# EasyEDA Pro project 智能车电驱.epro

# Schematic Schematic1
Board Name: Board1; Create Date: 2026-01-22; Page Name: P1; Project Name: 智能车电驱; Schematic Name: Schematic1; Update Date: 2026-01-22; Company: 轲硬件工作室; Drawed: 轲; Page Size: A4; Reviewed: 轲; Version: V1.0
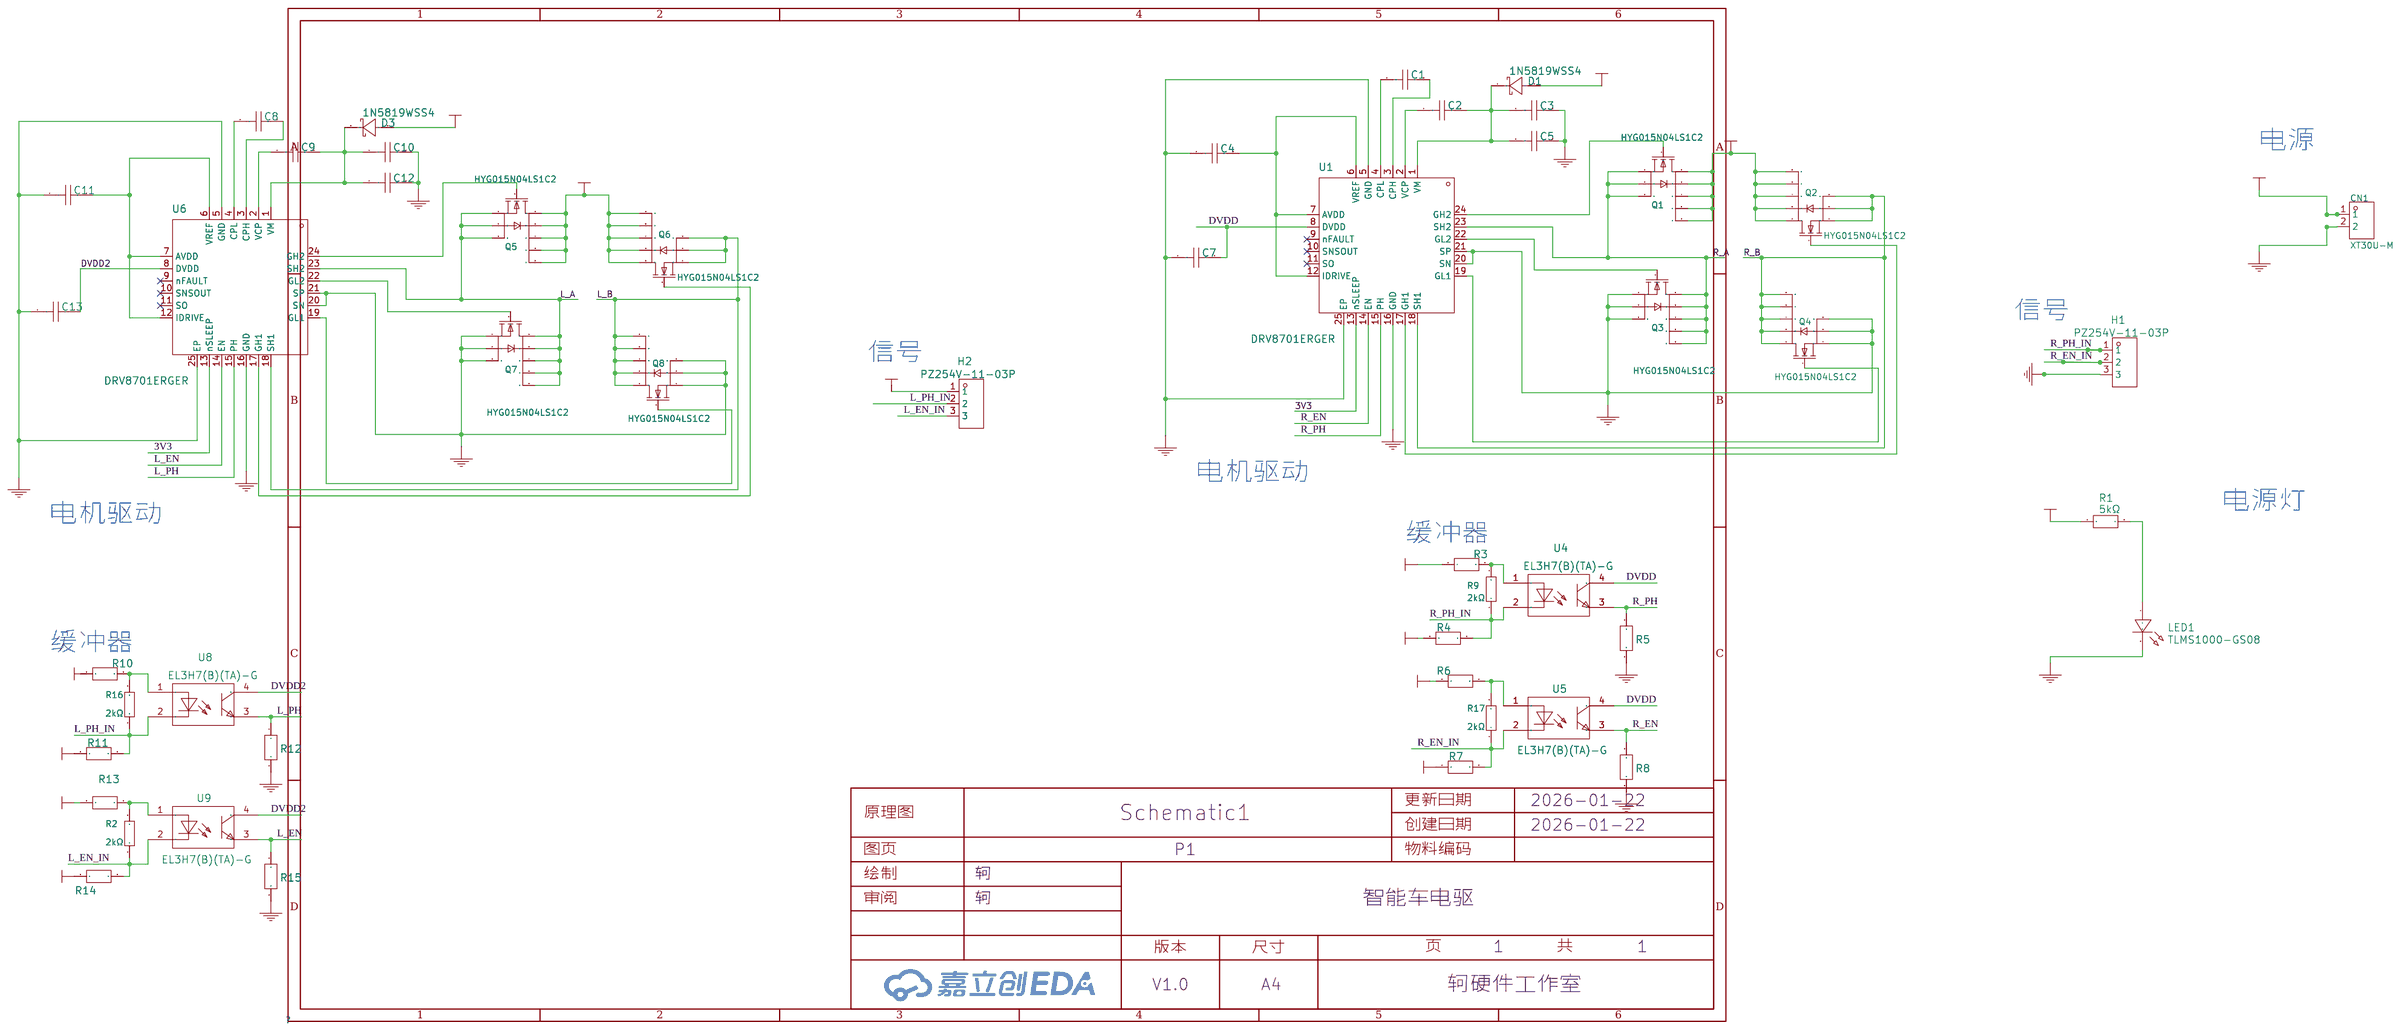
[diagram p0: schematic sheet]

## Parts
C1  100nF  [C0603]
C2  1uF  [C0603]
C3  10nF  [C0603]
C4  1uF  [C0603]
C5  100nF  [C0603]
C7  1uF  [C0603]
C8  100nF  [C0603]
C9  1uF  [C0603]
C10  10nF  [C0603]
C11  1uF  [C0603]
C12  100nF  [C0603]
C13  1uF  [C0603]
CN1  XT30U-M  [CONN-TH_XT30U-M]
D1  1N5819WSS4  [SOD-323_L1.6-W1.3-LS2.7-RD]
D3  1N5819WSS4  [SOD-323_L1.6-W1.3-LS2.7-RD]
H1  PZ254V-11-03P  [HDR-TH_3P-P2.54-V-M]
H2  PZ254V-11-03P  [HDR-TH_3P-P2.54-V-M]
LED1  TLMS1000-GS08  [LED0603-R-RD]
Q1  HYG015N04LS1C2  [DFN-8_L5.9-W5.2-P1.27-LS6.2-BL]
Q2  HYG015N04LS1C2  [DFN-8_L5.9-W5.2-P1.27-LS6.2-BL]
Q3  HYG015N04LS1C2  [DFN-8_L5.9-W5.2-P1.27-LS6.2-BL]
Q4  HYG015N04LS1C2  [DFN-8_L5.9-W5.2-P1.27-LS6.2-BL]
Q5  HYG015N04LS1C2  [DFN-8_L5.9-W5.2-P1.27-LS6.2-BL]
Q6  HYG015N04LS1C2  [DFN-8_L5.9-W5.2-P1.27-LS6.2-BL]
Q7  HYG015N04LS1C2  [DFN-8_L5.9-W5.2-P1.27-LS6.2-BL]
Q8  HYG015N04LS1C2  [DFN-8_L5.9-W5.2-P1.27-LS6.2-BL]
R1  5kΩ  [R0603]
R2  2kΩ  [R0603]
R3  1kΩ  [R0603]
R4  10kΩ  [R0603]
R5  10kΩ  [R0603]
R6  1kΩ  [R0603]
R7  10kΩ  [R0603]
R8  10kΩ  [R0603]
R9  2kΩ  [R0603]
R10  1kΩ  [R0603]
R11  10kΩ  [R0603]
R12  10kΩ  [R0603]
R13  1kΩ  [R0603]
R14  10kΩ  [R0603]
R15  10kΩ  [R0603]
R16  2kΩ  [R0603]
R17  2kΩ  [R0603]
U1  DRV8701ERGER  [VQFN-24_L4.0-W4.0-P0.50-BL-EP2.5]
U4  EL3H7(B)(TA)-G  [SOP-4_L4.4-W2.8-P1.27-LS7.0-TL]
U5  EL3H7(B)(TA)-G  [SOP-4_L4.4-W2.8-P1.27-LS7.0-TL]
U6  DRV8701ERGER  [VQFN-24_L4.0-W4.0-P0.50-BL-EP2.5]
U8  EL3H7(B)(TA)-G  [SOP-4_L4.4-W2.8-P1.27-LS7.0-TL]
U9  EL3H7(B)(TA)-G  [SOP-4_L4.4-W2.8-P1.27-LS7.0-TL]

## Library data of the parts
C1 C5 C8 C12 = CC0805KRX7R9BB104: 容值:100nF;精度:±10%;额定电压:50V;材质(温度系数):X7R;; LCSC Part Name: 100nF ±10% 50V; Supplier Part: C49678; Manufacturer: YAGEO(国巨); Supplier Footprint: 0805; JLCPCB Part Class: Basic Part; Datasheet: https://atta.szlcsc.com/upload/public/pdf/source/20151026/1457707504898.pdf; Supplier: LCSC; Tolerance: ±10%; Voltage Rated: 50V; Temperature Coefficient: X7R
C2 C4 C7 C9 C11 C13 = CC0805KKX7R9BB105: 容值:1uF;精度:±10%;额定电压:50V;材质(温度系数):X7R;; LCSC Part Name: 1uF ±10% 50V; Supplier Part: C91185; Manufacturer: YAGEO(国巨); Supplier Footprint: 0805; JLCPCB Part Class: Extended Part; Datasheet: https://atta.szlcsc.com/upload/public/pdf/source/20180326/C91185_73E5753CCDA19AEA5F66F742ADC085F8.pdf; Supplier: LCSC; Tolerance: ±10%; Voltage Rated: 50V; Temperature Coefficient: X7R
C3 C10 = CC0805KRX7R9BB103: 容值:10nF;精度:±10%;额定电压:50V;材质(温度系数):X7R;; LCSC Part Name: 10nF ±10% 50V; Supplier Part: C83170; Manufacturer: YAGEO(国巨); Supplier Footprint: 0805; JLCPCB Part Class: Extended Part; Datasheet: https://atta.szlcsc.com/upload/public/pdf/source/20160918/1474166948353.pdf; Supplier: LCSC; Tolerance: ±10%; Voltage Rated: 50V; Temperature Coefficient: X7R
CN1 = XT30U-M: 模型插头轻量版锂电池插头; LCSC Part Name: AMASS(艾迈斯)轻量版锂电池插头公头 XT30U-M; Supplier Part: C99101; Manufacturer: AMASS(艾迈斯); JLCPCB Part Class: 扩展库; Datasheet: https://atta.szlcsc.com/upload/public/pdf/source/20170606/1496716542582.pdf; Supplier: LCSC
D1 D3 = 1N5819WS S4_C2927280: 二极管配置:独立式;直流反向耐压(Vr):40V;平均整流电流(Io):350mA;正向压降(Vf):600mV@200mA;反向电流(Ir):5uA@30V;; LCSC Part Name: 40V 350mA 600mV@200mA; Supplier Part: C2927280; Manufacturer: JSMSEMI(杰盛微); Supplier Footprint: SOD-323; JLCPCB Part Class: ExtendedPart; Datasheet: https://atta.szlcsc.com/upload/public/pdf/source/20211230/020DF3ABCB41CBA5E28580D63AFB2CA3.pdf; Supplier: LCSC; Diode Configuration: 独立式; Reverse Voltage (Vr): 40V; Average Rectified Current (Io): 350mA; Forward Voltage (Vf@If): 600mV@200mA; Reverse Leakage Current (Ir): 5uA@30V
H1 H2 = PZ254V-11-03P: 排数:单排;总PIN位数:3;间距:2.54mm;插针结构:1x3P;行距:-;安装类型:直插;圆针/方针:方针;额定电流:3A;额定电压:250V;配合针长度:6mm;塑高:2.5mm;端接针长度:3mm;工作温度范围:-40℃~+105℃;颜色:黑色;; LCSC Part Name: 2.54mm 1x3P 直插 方针; Supplier Part: C2937625; Manufacturer: XFCN(兴飞); Supplier Footprint: 直插,P=2.54mm; JLCPCB Part Class: ExtendedPart; Datasheet: https://atta.szlcsc.com/upload/public/pdf/source/20200309/C492402_8335C3D49C4E4C618838D59BB1D024C1.pdf; Supplier: LCSC; Number of Rows: 单排; Number of Pins: 3; Pitch: 2.54mm; Pin Structure: 1x3P; Mounting Type: 直插; Circluar Pins/Square Pins: 方针; Current Rating (Max): 3A; Voltage Rating (Max): 250V; Length of Mating Pin: 6mm; Insulation Height: 2.5mm; Length of End Connection Pin: 3mm; Operating Temperature Range: -40℃~+105℃; Color: 黑色
LED1 = TLMS1000-GS08: 发光颜色:红灯;; LCSC Part Name: 红灯; Supplier Part: C241893; Manufacturer: VISHAY(威世); Supplier Footprint: 0603; JLCPCB Part Class: Extended Part; Datasheet: https://atta.szlcsc.com/upload/public/pdf/source/20180719/C241893_4BC7C846B3C52AB2D39E337E84999DF0.pdf; Supplier: LCSC; Emitted Color: 红灯
Q1-Q8 = HYG015N04LS1C2: 类型:N沟道;漏源电压(Vdss):40V;连续漏极电流(Id):150A;功率(Pd):75W;导通电阻(RDS(on)@Vgs,Id):1.4mΩ@10V,20A;阈值电压(Vgs(th)@Id):1.9V@250uA;栅极电荷(Qg@Vgs):27nC@4.5V;输入电容(Ciss@Vds):4.05nF@25V;反向传输电容(Crss@Vds):33pF@25V;工作温度:-55℃~+175℃@(Tj);; LCSC Part Name: N沟道40V150A; Supplier Part: C2874970; Manufacturer: HUAYI(华羿微); Supplier Footprint: DFN-8(5.2x5.9); JLCPCB Part Class: ExtendedPart; Datasheet: https://atta.szlcsc.com/upload/public/pdf/source/20210813/C5CB7DC3536D10310F1C24584D22DB85.pdf; Supplier: LCSC; Type: N沟道; Drain Source Voltage (Vdss): 40V; Continuous Drain Current (Id): 150A; Power Dissipation (Pd): 75W; Drain Source On Resistance (RDS(on)@Vgs,Id): 1.4mΩ@10V,20A; Gate Threshold Voltage (Vgs(th)@Id): 1.9V@250uA; Total Gate Charge (Qg@Vgs): 27nC@4.5V; Input Capacitance (Ciss@Vds): 4.05nF@25V; Reverse Transfer Capacitance (Crss@Vds): 33pF@25V; Operating Temperature: -55℃~+175℃@(Tj)
R1 = RC0603FR-072K2L: 电阻类型:厚膜电阻;阻值:2.2kΩ;精度:±1%;功率:100mW;; LCSC Part Name: 2.2kΩ ±1% 100mW; Supplier Part: C114662; Manufacturer: YAGEO(国巨); Supplier Footprint: 0603; JLCPCB Part Class: Extended Part; Datasheet: https://atta.szlcsc.com/upload/public/pdf/source/20170818/C114662_1503051152560895127.pdf; Supplier: LCSC; Type: 厚膜电阻; Tolerance: ±1%; Power(Watts): 100mW; Temperature Coefficient: ±100ppm/℃; Overload Voltage (Max): 75V; Operating Temperature Range: -55℃~+155℃
R2 R9 R16 R17 = 0603WAF2001T5E: 电阻类型:厚膜电阻;阻值:2kΩ;精度:±1%;功率:100mW;; LCSC Part Name: 2kΩ±1%100mW; Supplier Part: C22975; Manufacturer: UNI-ROYAL(厚声); Supplier Footprint: 0603; JLCPCB Part Class: BasicPart; Datasheet: https://atta.szlcsc.com/upload/public/pdf/source/20200306/C422600_1E6D84923E4A46A82E41ADD87F860B5C.pdf; Supplier: LCSC; Type: 厚膜电阻; Tolerance: ±1%; Power(Watts): 100mW; Temperature Coefficient: ±100ppm/℃; Overload Voltage (Max): 75V; Operating Temperature Range: -55℃~+155℃
R3 R6 R10 R13 = RC0603FR-071KL: 电阻类型:厚膜电阻;阻值:1kΩ;精度:±1%;功率:100mW;; LCSC Part Name: 1kΩ ±1% 100mW; Supplier Part: C22548; Manufacturer: YAGEO(国巨); Supplier Footprint: 0603; JLCPCB Part Class: Extended Part; Datasheet: https://atta.szlcsc.com/upload/public/pdf/source/20180312/7BD3618A8B6324EA6280B0497A051AB7.pdf; Supplier: LCSC; Type: 厚膜电阻; Tolerance: ±1%; Power(Watts): 100mW; Temperature Coefficient: ±100ppm/℃; Overload Voltage (Max): 75V; Operating Temperature Range: -55℃~+155℃
R4 R5 R7 R8 R11 R12 R14 R15 = RC0603FR-0710KL: 电阻类型:厚膜电阻;阻值:10kΩ;精度:±1%;功率:100mW;; LCSC Part Name: 10kΩ ±1% 100mW; Supplier Part: C98220; Manufacturer: YAGEO(国巨); Supplier Footprint: 0603; JLCPCB Part Class: Extended Part; Datasheet: https://atta.szlcsc.com/upload/public/pdf/source/20170522/1495423494387.pdf; Supplier: LCSC; Type: 厚膜电阻; Tolerance: ±1%; Power(Watts): 100mW; Temperature Coefficient: ±100ppm/℃; Overload Voltage (Max): 75V; Operating Temperature Range: -55℃~+155℃
U1 U6 = DRV8701ERGER: DRV8701 DRV8701 H 桥栅极驱动器; Supplier Part: C90964; Manufacturer: TI(德州仪器); Supplier Footprint: VQFN-24; JLCPCB Part Class: ExtendedPart; Datasheet: https://atta.szlcsc.com/upload/public/pdf/source/20190902/C90964_2DCC43C1A4AE58E3ED96296E8C78517C.pdf; Supplier: LCSC; Type: 有刷直流电机; Supply Voltage: 0V~5.5V; Interface: 并行; Operating Temperature: -40℃~+125℃@(Ta)
U4 U5 U8 U9 = EL3H7(B)(TA)-G: 输入电压类型:DC;输出通道数:1;正向电压:1.2V;反向电压:6V;输出电流:50mA;接收端电压:80V;集射极饱和电压(Vce(sat)@Ic,IF):100mV@1mA,10mA;隔离电压(rms):3.75kV;; LCSC Part Name: DC输入 隔离电压(rms):3750V; Supplier Part: C32565; Manufacturer: EVERLIGHT(亿光); Supplier Footprint: SOP-4-1.27mm; JLCPCB Part Class: BasicPart; Datasheet: https://atta.szlcsc.com/upload/public/pdf/source/20140621/1457707095564.pdf; Supplier: LCSC; Input voltage type: DC; Output Type: 光电三极管; Number of Outputs: 1; Forward Voltage: 1.2V; Reverse Voltage: 6V; Output Current: 50mA; Receiving End Voltage: 80V; Collector-Emitter Saturation Voltage (Vce(sat)@Ic,IF): 100mV@1mA,10mA; Rise time: 5us@2mA,100Ω; Fall time: 3us@2mA,100Ω; Isolation Voltage(rms): 3.75kV; Operating Temperature: -55℃~+110℃

## Nets
3V3: H2.1 R3.1 R4.2 R6.2 R7.1 R10.1 R11.2 R13.2 R14.1 U1.13(nSLEEP) U6.13(nSLEEP)
DVDD: C7.2 U1.8(DVDD) U4.4(COL) U5.4(COL)
DVDD2: C13.2 U6.8(DVDD) U8.4(COL) U9.4(COL)
GND: C3.2 C4.1 C5.2 C7.1 C10.2 C11.1 C12.2 C13.1 CN1.2 H1.3 LED1.2 Q3.1(S) Q3.2(S) Q3.3(S) Q4.1(S) Q4.2(S) Q4.3(S) Q7.1(S) Q7.2(S) Q7.3(S) Q8.1(S) Q8.2(S) Q8.3(S) R5.2 R8.2 R12.2 R15.2 U1.5(GND) U1.16(GND) U1.20(SN) U1.21(SP) U1.25(EP) U6.5(GND) U6.16(GND) U6.20(SN) U6.21(SP) U6.25(EP)
L_A: Q5.1(S) Q5.2(S) Q5.3(S) Q7.5(D) Q7.6(D) Q7.7(D) Q7.8(D) Q7.9(D) U6.23(SH2)
L_B: Q6.1(S) Q6.2(S) Q6.3(S) Q8.5(D) Q8.6(D) Q8.7(D) Q8.8(D) Q8.9(D) U6.18(SH1)
L_EN: R15.1 U6.14(EN) U9.3(EM)
L_EN_IN: H2.3 R2.1 R14.2 U9.2(CAT)
L_PH: R12.1 U6.15(PH) U8.3(EM)
L_PH_IN: H2.2 R11.1 R16.1 U8.2(CAT)
R_A: Q1.1(S) Q1.2(S) Q1.3(S) Q3.5(D) Q3.6(D) Q3.7(D) Q3.8(D) Q3.9(D) U1.23(SH2)
R_B: Q2.1(S) Q2.2(S) Q2.3(S) Q4.5(D) Q4.6(D) Q4.7(D) Q4.8(D) Q4.9(D) U1.18(SH1)
R_EN: R8.1 U1.14(EN) U5.3(EM)
R_EN_IN: H1.2 R7.2 R17.1 U5.2(CAT)
R_PH: R5.1 U1.15(PH) U4.3(EM)
R_PH_IN: H1.1 R4.1 R9.1 U4.2(CAT)
VM: CN1.1 D1.2(A) D3.2(A) Q1.5(D) Q1.6(D) Q1.7(D) Q1.8(D) Q1.9(D) Q2.5(D) Q2.6(D) Q2.7(D) Q2.8(D) Q2.9(D) Q5.5(D) Q5.6(D) Q5.7(D) Q5.8(D) Q5.9(D) Q6.5(D) Q6.6(D) Q6.7(D) Q6.8(D) Q6.9(D) R1.1
$1N1262: Q3.4(G) U1.22(GL2)
$1N1263: Q4.4(G) U1.19(GL1)
$1N1264: C4.2 U1.6(VREF) U1.7(AVDD) U1.12(IDRIVE)
$1N1265: C1.1 U1.4(CPL)
$1N1266: C2.1 U1.2(VCP)
$1N1267: C2.2 C3.1 C5.1 D1.1(C) U1.1(VM)
$1N1268: Q1.4(G) U1.24(GH2)
$1N1269: Q2.4(G) U1.17(GH1)
$1N1297: C1.2 U1.3(CPH)
$1N1308: LED1.1 R1.2
$1N1312: R3.2 R9.2 U4.1(AN)
$1N1315: R6.1 R17.2 U5.1(AN)
$3N3922: Q7.4(G) U6.22(GL2)
$3N3923: Q8.4(G) U6.19(GL1)
$3N3924: C11.2 U6.6(VREF) U6.7(AVDD) U6.12(IDRIVE)
$3N3925: C8.1 U6.4(CPL)
$3N3926: C9.1 U6.2(VCP)
$3N3927: C9.2 C10.1 C12.1 D3.1(C) U6.1(VM)
$3N3928: Q5.4(G) U6.24(GH2)
$3N3929: Q6.4(G) U6.17(GH1)
$3N3958: C8.2 U6.3(CPH)
$3N3966: R10.2 R16.2 U8.1(AN)
$3N3971: R2.2 R13.1 U9.1(AN)

Not connected (* = marked no-connect by the designer): U1 9(nFAULT)* 10(SNSOUT)* 11(SO)*; U6 9(nFAULT)* 10(SNSOUT)* 11(SO)*

## Notes on the sheet
- 电源
- 信号
- 信号
- 电机驱动
- 电源灯
- 电机驱动
- 缓冲器
- 缓冲器

# Board PCB1
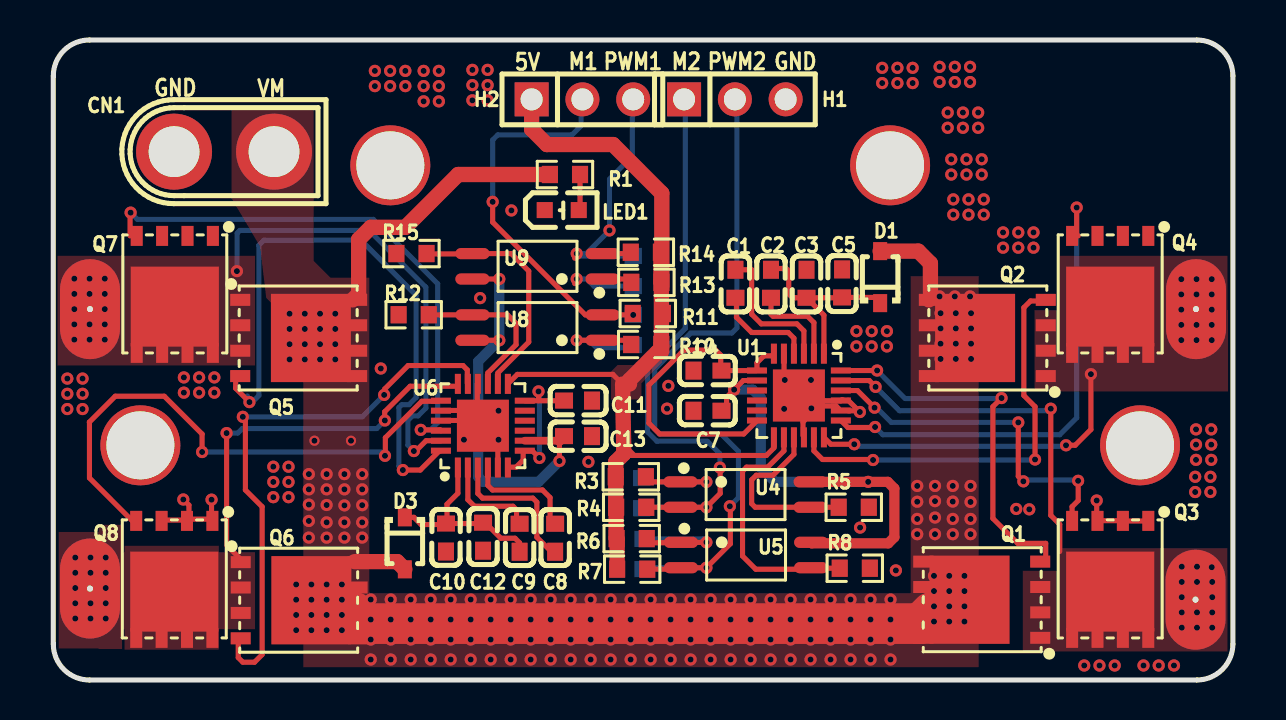
[diagram p1: board, top side]
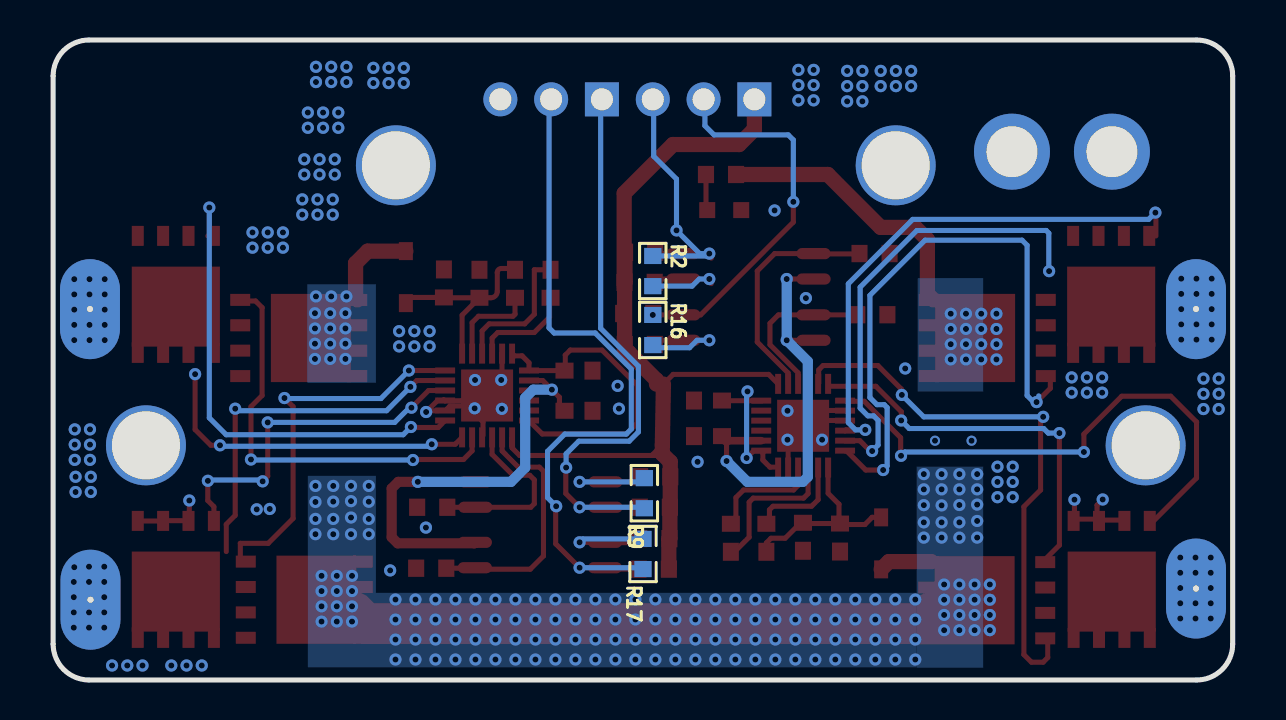
[diagram p2: board, bottom side, seen from below]

Outline 59 x 32 mm; copper layers: Top Layer, Bottom Layer. Coordinates in mm from the lower left corner of the outline.
Outline path: 0,30.2 0,1.8 arc(0.53,0.53) 1.8,0 57.2,0 arc(58.47,0.53) 59,1.8 59,30.2 arc(58.47,31.47) 57.2,32 1.8,32 arc(0.53,31.47) 0,30.2
Stack: Top Layer 0.035mm / Dielectric1 1.51mm FR4 er 4.5 / Bottom Layer 0.035mm

## Design rules (mm)
template: JLCPCB Capability(Two Layers Board)
spacing copperThickness1oz (default): track to track 0.102, other pairs 0.152 to 0.3
spacing copperThickness2oz: track to track 0.203, other pairs 0.152 to 0.3
track width copperThickness1oz (default): min 0.127, default 0.254, max 2.54
track width copperThickness2oz: min 0.203, default 0.254, max 2.54
differential pair differentialPair (default): width min 0.127, default 0.254, max 2.54; gap min 0.152, default 0.152
via viaSize (default): diameter min 0.5, default 0.61, max 10; hole min 0.3, default 0.305, max 6.3

## Placement (name value [footprint] x y rotation side)
C1  100nF  [C0603]  34.12 19.81 90 top
C2  1uF  [C0603]  35.9 19.81 90 top
C3  10nF  [C0603]  37.67 19.81 90 top
C4  1uF  [C0603]  32.72 15.47 0 top
C5  100nF  [C0603]  39.45 19.83 90 top
C7  1uF  [C0603]  32.72 13.46 0 top
C8  100nF  [C0603]  25.1 7.11 270 top
C9  1uF  [C0603]  23.32 7.11 270 top
C10  10nF  [C0603]  19.64 7.12 270 top
C11  1uF  [C0603]  26.24 13.97 180 top
C12  100nF  [C0603]  21.49 7.16 270 top
C13  1uF  [C0603]  26.24 12.19 180 top
CN1  XT30U-M  [CONN-TH_XT30U-M]  8.54 26.42 180 top
D1  1N5819WSS4  [SOD-323_L1.6-W1.3-LS2.7-RD]  41.36 20.14 90 top
D3  1N5819WSS4  [SOD-323_L1.6-W1.3-LS2.7-RD]  17.58 6.83 270 top
H1  PZ254V-11-03P  [HDR-TH_3P-P2.54-V-M]  34.09 29.03 0 top
H2  PZ254V-11-03P  [HDR-TH_3P-P2.54-V-M]  26.46 29.03 0 top
LED1  TLMS1000-GS08  [LED0603-R-RD]  25.43 23.5 0 top
NOREF  -  [Pad_e1132]  54.36 11.73 0 top
NOREF#2  -  [Pad_e1133]  57.13 4.01 90 top
NOREF#3  -  [Pad_e1134]  57.16 18.54 90 top
NOREF#4  -  [Pad_e1130]  16.86 25.73 0 top
NOREF#5  -  [Pad_e1131]  41.85 25.73 0 top
NOREF#6  -  [Pad_e1127]  1.83 4.57 90 top
NOREF#7  -  [Pad_e1129]  4.35 11.73 0 top
NOREF#8  -  [Pad_e1128]  1.83 18.54 90 top
Q1  HYG015N04LS1C2  [DFN-8_L5.9-W5.2-P1.27-LS6.2-BL]  46.44 4.01 90 top
Q2  HYG015N04LS1C2  [DFN-8_L5.9-W5.2-P1.27-LS6.2-BL]  46.72 17.1 90 top
Q3  HYG015N04LS1C2  [DFN-8_L5.9-W5.2-P1.27-LS6.2-BL]  52.86 5.03 180 top
Q4  HYG015N04LS1C2  [DFN-8_L5.9-W5.2-P1.27-LS6.2-BL]  52.86 19.28 180 top
Q5  HYG015N04LS1C2  [DFN-8_L5.9-W5.2-P1.27-LS6.2-BL]  12.27 17.1 270 top
Q6  HYG015N04LS1C2  [DFN-8_L5.9-W5.2-P1.27-LS6.2-BL]  12.3 3.99 270 top
Q7  HYG015N04LS1C2  [DFN-8_L5.9-W5.2-P1.27-LS6.2-BL]  6.08 19.28 180 top
Q8  HYG015N04LS1C2  [DFN-8_L5.9-W5.2-P1.27-LS6.2-BL]  6.05 5.03 180 top
R1  5kΩ  [R0603]  25.59 25.27 0 top
R2  2kΩ  [R0603]  29 20.45 270 bottom
R3  1kΩ  [R0603]  28.88 10.16 0 top
R4  10kΩ  [R0603]  28.9 8.64 180 top
R5  10kΩ  [R0603]  40.04 8.64 0 top
R6  1kΩ  [R0603]  28.93 7.07 180 top
R7  10kΩ  [R0603]  28.95 5.54 0 top
R8  10kΩ  [R0603]  40.09 5.59 0 top
R9  2kΩ  [R0603]  29.43 9.34 90 bottom
R10  1kΩ  [R0603]  29.65 16.78 180 top
R11  10kΩ  [R0603]  29.74 18.33 0 top
R12  10kΩ  [R0603]  18.03 18.26 180 top
R13  1kΩ  [R0603]  29.66 19.88 0 top
R14  10kΩ  [R0603]  29.64 21.39 180 top
R15  10kΩ  [R0603]  17.91 21.32 180 top
R16  2kΩ  [R0603]  29 17.5 270 bottom
R17  2kΩ  [R0603]  29.49 6.3 90 bottom
U1  DRV8701ERGER  [VQFN-24_L4.0-W4.0-P0.50-BL-EP2.5]  37.29 14.22 180 top
U4  EL3H7(B)(TA)-G  [SOP-4_L4.4-W2.8-P1.27-LS7.0-TL]  34.63 9.27 0 top
U5  EL3H7(B)(TA)-G  [SOP-4_L4.4-W2.8-P1.27-LS7.0-TL]  34.65 6.25 0 top
U6  DRV8701ERGER  [VQFN-24_L4.0-W4.0-P0.50-BL-EP2.5]  21.49 12.72 0 top
U8  EL3H7(B)(TA)-G  [SOP-4_L4.4-W2.8-P1.27-LS7.0-TL]  24.22 17.62 180 top
U9  EL3H7(B)(TA)-G  [SOP-4_L4.4-W2.8-P1.27-LS7.0-TL]  24.22 20.68 180 top

## Footprints (pads in the part's own frame, mm; a bottom-side part is the same pattern mirrored in y, then rotated)
C0603
  rect 0.8x0.9 smd: 1(-0.7,0)
  rect 0.9x0.8 smd: 2(0.7,0)
CONN-TH_XT30U-M
  round 3.8 hole 2.54: 1(-2.5,0) 2(2.5,0)
DFN-8_L5.9-W5.2-P1.27-LS6.2-BL
  rect 0.6x1 smd: 1(-1.905,-2.925) 2(-0.635,-2.925) 3(0.635,-2.925) 4(1.905,-2.925) 5(1.905,2.925) 6(0.635,2.925) 7(-0.635,2.925) 8(-1.905,2.925)
  rect 4.41x4 smd: 9(0,0.61)
HDR-TH_3P-P2.54-V-M
  rect 1.7x1.7 hole 1.1: 1(-2.54,0)
  round 1.7 hole 1.1: 2(0,0) 3(2.54,0)
LED0603-R-RD
  rect 0.8x0.8 smd: 1(0.851,0) 2(-0.851,0)
Pad_e1127
  rrect 5.002x2.999 hole 0.305: 1(0,0)
Pad_e1128
  rrect 5.002x2.999 hole 0.305: 1(0,0)
Pad_e1129
  round 4 hole 3.401: 1(0,0)
Pad_e1130
  round 4 hole 3.401: 1(0,0)
Pad_e1131
  round 4 hole 3.401: 1(0,0)
Pad_e1132
  round 4 hole 3.401: 1(0,0)
Pad_e1133
  rrect 5.002x2.999 hole 0.305: 1(0,0)
Pad_e1134
  rrect 5.002x2.999 hole 0.305: 1(0,0)
R0603
  rect 0.806x0.864 smd: 1(-0.753,0) 2(0.753,0)
SOD-323_L1.6-W1.3-LS2.7-RD
  rect 0.9x0.7 smd: 1(-1.3,0) 2(1.3,0)
SOP-4_L4.4-W2.8-P1.27-LS7.0-TL
  oval 1.71x0.56 smd: 1(-3.255,0.635) 2(-3.255,-0.635) 3(3.255,-0.635) 4(3.255,0.635)
VQFN-24_L4.0-W4.0-P0.50-BL-EP2.5
  rect 0.3x1 smd: 1(-1.25,-2.092) 2(-0.75,-2.092) 3(-0.25,-2.092) 4(0.25,-2.092) 5(0.75,-2.092) 6(1.25,-2.092) 13(1.25,2.092) 14(0.75,2.092) 15(0.25,2.092) 16(-0.25,2.092) 17(-0.75,2.092) 18(-1.25,2.092)
  rect 1x0.3 smd: 7(2.098,-1.25) 8(2.098,-0.75) 9(2.098,-0.25) 10(2.098,0.25) 11(2.098,0.75) 12(2.098,1.25) 19(-2.098,1.25) 20(-2.098,0.75) 21(-2.098,0.25) 22(-2.098,-0.25) 23(-2.098,-0.75) 24(-2.098,-1.25)
  rect 2.6x2.6 smd: 25(0.001,-0.001)

## Nets
As in the schematic, except:
L_A: NOREF#8.1 Q5.1 Q5.2 Q5.3 Q7.5 Q7.6 Q7.7 Q7.8 Q7.9 U6.23
L_B: NOREF#6.1 Q6.1 Q6.2 Q6.3 Q8.5 Q8.6 Q8.7 Q8.8 Q8.9 U6.18
R_A: NOREF#2.1 Q1.1 Q1.2 Q1.3 Q3.5 Q3.6 Q3.7 Q3.8 Q3.9 U1.23
R_B: NOREF#3.1 Q2.1 Q2.2 Q2.3 Q4.5 Q4.6 Q4.7 Q4.8 Q4.9 U1.18

Pads without a net: NOREF 1; NOREF#4 1; NOREF#5 1; NOREF#7 1; U1 9 10 11; U6 9 10 11

## Via types
v1: diameter 0.61, hole 0.305, Top Layer to Bottom Layer, 419 vias
v2: diameter 0.508, hole 0.305, Top Layer to Bottom Layer, 3 vias

## Routing (per net, layer and track width the routed paths; a pad name or vN(x,y) marks a point on that pad's centre or on a via; arc(x,y) is an arc through that point)
3V3: length 46.1
  Top Layer w0.254: 28.53,11.3 28.6,11.23 29.06,11.23 ; R10.1 30.41,16.38 ; U6.13 23.21,15.28 27.99,15.28 28.47,14.8 28.82,14.8 ; 29.06,11.23 35.67,11.23 36.04,11.6 U1.13 ; 29.06,11.23 28.53,11.76
  Top Layer w0.762: 30.41,16.38 30.21,16.38 28.82,15 28.82,14.8 ; R7.1 28.2,7.04 R6.2 28.15,7.09 R4.2 28.13,8.66 R3.1 28.13,10.91 28.53,11.3 28.53,11.76 28.47,14.8 ; R14.1 30.39,19.91 R13.2 30.42,16.78 R10.1 ; 23.92,28.92 23.92,27.53 24.69,26.77 28,26.77 30.43,24.33 30.43,19.72
DVDD: length 24.4
  Top Layer w0.254: 35.19,14.97 34.51,14.97 v1(34.05,14.52) 33.67,14.14 33.67,13.72 C7.2
  Top Layer w0.508: 37.88,6.88 37.93,6.83 41.76,6.83 42.07,7.14 42.07,9.58 41.74,9.91 v1(40.76,9.91) U4.4
  Bottom Layer w0.508: 40.8,9.91 36.1,9.91 35.39,10.62 35.39,14.11 34.98,14.52 v1(34.05,14.52)
DVDD2: length 20.6
  Top Layer w0.254: 25.31,11.97 v1(25.31,10.95) ; v1(22.31,20.05) U9.4 ; U8.4 22.23,16.99
  Top Layer w0.381: U6.8 25.31,11.97
  Top Layer w0.508: 25.31,11.97 C13.2
  Bottom Layer w0.508: v1(22.31,16.99) 21.25,15.93 21.25,10.16 21.5,9.91 24.27,9.91 v1(25.31,10.95) ; 22.31,16.99 v1(22.31,20.05)
GND: length 26
  Top Layer w0.254: 38.3,13.7 39.15,13.7 39.3,13.55 ; 38.3,13.7 38.56,13.96 39.4,13.96 39.42,13.98 ; 38.3,13.7 38.18,13.7 ; 38.3,13.7 37.5,12.9 37.5,12.22 ; 6.78,8.04 6.78,8.74 v1(6.5,9.03) ; 6.78,8.04 6.78,8 ; 6.78,8.04 7.86,8.04 7.89,8.02 ; 6.78,8.04 6.71,8.04 ; v1(52.19,8.97) 52.19,8.05 ; 39.42,13.98 39.46,14.02 ; 39.42,13.98 39.76,13.98 40.28,13.46 ; 39.42,13.98 39.4,13.98 ; 19.5,13.48 20.68,13.48 21.18,12.98 ; 6.84,7.99 6.83,8 5.49,8 ; 36.55,16.39 36.55,14.99 38.01,13.52 ; 21.18,12.98 21.21,12.95 ; 21.18,12.98 21.21,12.98 ; 21.18,12.98 19.61,12.98 ; 21.21,12.95 21.21,12.55 22.23,11.53 22.23,10.85 ; 21.21,12.95 21.51,12.65 ; 21.21,12.95 21.21,12.98 ; 21.21,12.98 21.25,12.98 ; 21.21,12.98 21.21,14.83 ; v1(7.91,9.02) 7.91,7.93 7.93,7.92 ; 54.65,7.95 53.65,7.95 ; 53.65,7.95 53.68,7.92 ; 53.65,7.95 53.63,7.97 52.26,7.97 ; 39.75,13.46 40.28,13.46 ; 40.28,13.46 v1(40.34,13.4)
  vias: v1(0.7,15.07) v1(0.7,14.31) v1(0.7,13.55) v1(1.46,15.07) v1(1.46,14.31) v1(1.46,13.55) v1(6.53,15.13) v1(6.53,14.37) v1(7.29,15.13) v1(7.29,14.37) v1(8.05,15.13) v1(8.05,14.37) v1(11,10.67) v1(11,9.9) v1(11,9.14) v1(11.77,10.67) v1(11.77,9.9) v1(11.77,9.14) v1(16.08,30.46) v1(16.08,29.69) v1(16.38,15.58) v1(16.85,30.46) v1(16.85,29.69) v1(17.61,30.46) v1(17.61,29.69) v1(18.52,30.46) v1(18.52,29.69) v1(18.52,28.93) v1(19.28,30.46) v1(19.28,29.69) v1(19.28,28.93) v1(20.54,12.01) v1(20.96,30.51) v1(20.96,29.74) v1(20.96,28.98) v1(21.35,19.09) v1(21.72,30.51) v1(21.72,29.74) v1(21.72,28.98) v1(22.27,13.46) v1(22.27,12.01) v1(22.91,23.48) v1(26.76,10.91) v1(30.76,14.71) v1(30.7,13.57) v1(36.59,15) v1(36.55,13.56) v1(37.9,15) v1(37.91,13.58) v1(40.17,17.44) v1(40.17,16.68) v1(40.35,7.62) v1(40.93,17.44) v1(40.93,16.68) v1(41.46,30.61) v1(41.46,29.85) v1(41.69,17.44) v1(41.69,16.68) v1(42.14,5.48) v1(42.22,30.61) v1(42.22,29.85) v1(42.98,30.61) v1(42.98,29.85) v1(44.33,30.66) v1(44.33,29.9) v1(44.73,28.37) v1(44.73,27.61) v1(44.91,26.04) v1(44.91,25.27) v1(45.01,24.03) v1(45.01,23.27) v1(45.09,30.66) v1(45.09,29.9) v1(45.5,28.37) v1(45.5,27.61) v1(45.67,26.04) v1(45.67,25.27) v1(45.78,24.03) v1(45.78,23.27) v1(45.85,30.66) v1(45.85,29.9) v1(46.26,28.37) v1(46.26,27.61) v1(46.44,26.04) v1(46.44,25.27) v1(46.54,24.03) v1(46.54,23.27) v1(47.5,22.38) v1(47.5,21.62) v1(48.16,8.55) v1(48.27,22.38) v1(48.27,21.62) v1(48.81,8.53) v1(49.03,22.38) v1(49.03,21.62) v1(51.56,0.73) v1(52.33,0.73) v1(53.09,0.73) v1(54.53,0.73) v1(55.29,0.73) v1(56.05,0.73) v1(57.16,12.53) v1(57.16,11.77) v1(57.16,11.01) v1(57.11,10.16) v1(57.11,9.4) v1(57.88,10.16) v1(57.88,9.4) v1(57.92,12.53) v1(57.92,11.77) v1(57.92,11.01)
L_A: length 23
  Top Layer w0.254: v1(18.03,11.45) 18.13,11.45 18.65,11.97 U6.23
  Bottom Layer w0.254: v1(18.03,11.45) 17.74,11.75 17.74,12.98 17.96,13.21 18.25,13.21 18.63,13.59 18.63,19.64 15.8,22.48 9.33,22.48 9.2,22.34 9.2,20.46 v1(9.18,20.44)
  vias: v1(1.05,20.07) v1(1.05,19.31) v1(1.05,18.54) v1(1.05,17.78) v1(1.05,17.02) v1(1.81,20.07) v1(1.81,19.31) v1(1.81,17.78) v1(1.81,17.02) v1(2.57,20.07) v1(2.57,19.31) v1(2.57,18.54) v1(2.57,17.78) v1(2.57,17.02)
L_B: length 19.2
  Top Layer w0.254: v1(8.67,12.35) 8.67,6.74 9.36,6.05 ; 20.09,14.69 17.85,14.69 16.57,13.41 16.57,13.06
  Bottom Layer w0.254: v1(16.58,12.98) 16.18,12.57 9.45,12.57 9.23,12.35 v1(8.67,12.35)
  vias: v1(1.1,6.12) v1(1.1,5.36) v1(1.1,4.6) v1(1.1,3.84) v1(1.1,3.07) v1(1.86,6.12) v1(1.86,5.36) v1(1.86,3.84) v1(1.86,3.07) v1(2.62,6.12) v1(2.62,5.36) v1(2.62,4.6) v1(2.62,3.84) v1(2.62,3.07)
L_EN: length 11.8
  Top Layer w0.254: 18.62,21.3 20.95,21.3 U9.3 22.91,21.32 23.78,20.45 23.78,16.9 22.24,15.35 U6.14
L_EN_IN: length 13.8
  Top Layer w0.254: R14.2 28.82,21.32 U9.2 ; 26.08,21.09 26.18,21.19 v1(26.18,21.32)
  Bottom Layer w0.254: R2.1 26.3,21.2 v1(26.18,21.32) 26.66,21.32 v1(27.82,22.48) 27.82,25.05 28.96,26.19 28.96,28.74 28.67,29.03
L_PH: length 8.1
  Top Layer w0.254: U6.15 21.73,15.36 23.14,16.77 23.14,17.83 22.72,18.26 U8.3 18.88,18.26
L_PH_IN: length 19.3
  Top Layer w0.254: 28.91,18.3 28.87,18.26 U8.2 26.61,18.26 21.97,22.89 v1(21.97,23.91)
  Bottom Layer w0.254: v1(21.97,23.91) 21.97,27 22.23,27.26 25.94,27.26 26.4,27.71 26.4,29.29
  vias: v2(29,18.25)
R_A: length 18.5
  Top Layer w0.254: 50.34,6.42 50.34,7.78 49.89,8.23 v1(49.89,13.56) ; v1(41.13,14.66) 40.81,14.97 39.39,14.97
  Bottom Layer w0.254: v1(41.13,14.66) 42.32,13.46 49.79,13.46 v1(49.89,13.56)
  vias: v1(56.44,5.67) v1(56.44,4.9) v1(56.44,4.14) v1(56.44,3.38) v1(56.44,2.62) v1(57.2,5.67) v1(57.2,4.9) v1(57.2,3.38) v1(57.2,2.62) v1(57.94,5.64) v1(57.97,4.9) v1(57.97,4.14) v1(57.97,3.38) v1(57.97,2.62)
R_B: length 16.7
  Top Layer w0.254: v1(40.06,11.79) 38.89,11.79 U1.18 ; v1(51.9,15.29) 51.9,12.52 51.11,11.74 v1(50.65,11.74)
  Bottom Layer w0.254: v1(40.06,11.79) 40.16,11.69 50.6,11.69 v1(50.65,11.74)
  vias: v1(56.42,20.04) v1(56.42,19.28) v1(56.42,18.52) v1(56.42,17.76) v1(56.42,16.99) v1(57.18,20.04) v1(57.18,19.28) v1(57.18,17.76) v1(57.18,16.99) v1(57.94,20.04) v1(57.94,19.28) v1(57.94,18.52) v1(57.94,17.76) v1(57.94,16.99)
R_EN: length 12.6
  Top Layer w0.254: U1.14 36.54,11.45 35.73,10.64 34.68,10.64 34.47,10.44 34.47,6.2 35.13,5.54 37.83,5.54 37.88,5.59 R8.1
R_EN_IN: length 36.8
  Top Layer w0.254: 31.37,5.61 v1(32.67,5.61) 33.86,6.81 33.86,8.66 v1(33.84,8.69) ; 31.37,5.59 31.32,5.54 R7.2
  Bottom Layer w0.254: 34.46,29.03 34.19,28.77 34.19,17.6 33.94,17.35 31.88,17.35 30.08,15.55 30.08,12.55 30.33,12.3 33.41,12.3 34.27,11.43 34.27,9.12 v1(33.84,8.69) ; R17.1 29.56,5.61 v1(32.67,5.61)
R_PH: length 9.1
  Top Layer w0.254: R5.1 U4.3 35.11,8.64 34.93,8.81 34.93,10.01 35.16,10.24 36,10.24 37.04,11.28 U1.15
R_PH_IN: length 30.6
  Top Layer w0.254: 32.62,8.64 U4.2 29.66,8.64 ; 33.36,10.54 33.36,9.33 v1(32.67,8.64)
  Bottom Layer w0.254: v1(33.34,10.62) 33.34,11.31 32.71,11.94 30.19,11.94 29.72,12.4 29.72,15.69 31.61,17.58 31.61,29.03 ; v1(32.67,8.64) 29.48,8.64 R9.1
VM: length 50.7
  Top Layer w0.762: 14.97,19.01 15.27,19.31 15.27,22.02 15.88,22.63 17.61,22.63 20.25,25.27 R1.1 ; Q2.5 43.87,19.09 43.87,20.83 43.26,21.44 D1.2 ; 15.07,5.92 17.2,5.92 D3.2
  Top Layer w2.032: 15.07,3.38 15.63,2.82 43.36,2.82 43.92,3.38
  vias: v1(11.82,18.31) v1(11.82,17.55) v1(11.82,16.79) v1(11.82,16.03) v1(12.15,4.78) v1(12.15,4.01) v1(12.15,3.25) v1(12.15,2.49) v1(12.58,18.31) v1(12.58,17.55) v1(12.58,16.79) v1(12.58,16.03) v1(12.78,10.29) v1(12.78,9.53) v1(12.78,8.77) v1(12.78,7.95) v1(12.78,7.12) v1(12.91,4.78) v1(12.91,4.01) v1(12.91,3.25) v1(12.91,2.49) v1(13.34,18.31) v1(13.34,17.55) v1(13.34,16.79) v1(13.34,16.03) v1(13.67,10.29) v1(13.67,9.53) v1(13.67,8.75) v1(13.67,7.88) v1(13.67,7.12) v1(13.67,4.78) v1(13.67,4.01) v1(13.67,3.25) v1(13.67,2.49) v1(14.1,18.31) v1(14.1,17.55) v1(14.1,16.79) v1(14.1,16.03) v1(14.43,4.78) v1(14.43,4.01) v1(14.43,3.25) v1(14.43,2.49) v1(14.56,10.29) v1(14.56,9.53) v1(14.56,8.73) v1(14.56,7.88) v1(14.56,7.12) v1(15.45,10.29) v1(15.45,9.53) v1(15.45,8.74) v1(15.45,7.88) v1(15.45,7.12) v1(15.88,4.02) v1(15.88,3.02) v1(15.88,2.02) v1(15.88,1.02) v1(16.88,4.02) v1(16.88,3.02) v1(16.88,2.02) v1(16.88,1.02) v1(17.88,4.02) v1(17.88,3.02) v1(17.88,2.02) v1(17.88,1.02) v1(18.88,4.02) v1(18.88,3.02) v1(18.88,2.02) v1(18.88,1.02) v1(19.88,4.02) v1(19.88,3.02) v1(19.88,2.02) v1(19.88,1.02) v1(20.88,4.02) v1(20.88,3.02) v1(20.88,2.02) v1(20.88,1.02) v1(21.88,4.02) v1(21.88,3.02) v1(21.88,2.02) v1(21.88,1.02) v1(22.88,4.02) v1(22.88,3.02) v1(22.88,2.02) v1(22.88,1.02) v1(23.88,4.02) v1(23.88,3.02) v1(23.88,2.02) v1(23.88,1.02) v1(24.88,4.02) v1(24.88,3.02) v1(24.88,2.02) v1(24.88,1.02) v1(25.88,4.02) v1(25.88,3.02) v1(25.88,2.02) v1(25.88,1.02) v1(26.88,4.02) v1(26.88,3.02) v1(26.88,2.02) v1(26.88,1.02) v1(27.88,4.02) v1(27.88,3.02) v1(27.88,2.02) v1(27.88,1.02) v1(28.88,4.02) v1(28.88,3.02) v1(28.88,2.02) v1(28.88,1.02) v1(29.88,4.02) v1(29.88,3.02) v1(29.88,2.02) v1(29.88,1.02) v1(30.88,4.02) v1(30.88,3.02) v1(30.88,2.02) v1(30.88,1.02) v1(31.88,4.02) v1(31.88,3.02) v1(31.88,2.02) v1(31.88,1.02) v1(32.88,4.02) v1(32.88,3.02) v1(32.88,2.02) v1(32.88,1.02) v1(33.88,4.02) v1(33.88,3.02) v1(33.88,2.02) v1(33.88,1.02) v1(34.88,4.02) v1(34.88,3.02) v1(34.88,2.02) v1(34.88,1.02) v1(35.88,4.02) v1(35.88,3.02) v1(35.88,2.02) v1(35.88,1.02) v1(36.88,4.02) v1(36.88,3.02) v1(36.88,2.02) v1(36.88,1.02) v1(37.88,4.02) v1(37.88,3.02) v1(37.88,2.02) v1(37.88,1.02) v1(38.88,4.02) v1(38.88,3.02) v1(38.88,2.02) v1(38.88,1.02) v1(39.88,4.02) v1(39.88,3.02) v1(39.88,2.02) v1(39.88,1.02) v1(40.88,4.02) v1(40.88,3.02) v1(40.88,2.02) v1(40.88,1.02) v1(41.88,4.02) v1(41.88,3.02) v1(41.88,2.02) v1(41.88,1.02) v1(43.21,9.7) v1(43.21,8.91) v1(43.21,8.05) v1(43.21,7.29) v1(44.05,5.21) v1(44.05,4.45) v1(44.05,3.68) v1(44.05,2.92) v1(44.1,9.7) v1(44.1,8.94) v1(44.1,8.12) v1(44.1,7.29) v1(44.33,19.18) v1(44.38,18.34) v1(44.38,17.58) v1(44.38,16.82) v1(44.38,16.05) v1(44.81,5.21) v1(44.81,4.45) v1(44.81,3.68) v1(44.81,2.92) v1(44.99,9.7) v1(44.99,8.92) v1(44.99,8.05) v1(44.99,7.29) v1(45.09,19.18) v1(45.14,18.34) v1(45.14,17.58) v1(45.14,16.82) v1(45.14,16.05) v1(45.57,5.21) v1(45.57,4.45) v1(45.57,3.68) v1(45.57,2.92) v1(45.85,19.18) v1(45.88,9.7) v1(45.88,8.9) v1(45.88,8.05) v1(45.88,7.29) v1(45.9,18.34) v1(45.9,17.58) v1(45.9,16.82) v1(45.9,16.05) v2(13.06,11.96) v2(14.89,11.96)
$1N1262: length 17
  Top Layer w0.254: U1.22 40.22,14.47 v1(41.08,13.62) ; 51.26,9.63 51.26,8.97 50.96,8.67 50.96,8.11 ; v1(48.52,9.93) 48.27,10.19 v1(48.27,12.88)
  Bottom Layer w0.254: v1(48.52,9.93) 48.59,10 51.22,10 v1(51.26,9.96) ; v1(41.08,13.62) 41.18,13.62 41.92,12.88 v1(48.27,12.88)
$1N1263: length 24.4
  Top Layer w0.254: 51.26,22.2 51.19,22.28 v1(51.19,23.62) ; v1(41.1,12.65) 41.08,12.62 39.74,12.62 U1.19
  Bottom Layer w0.254: v1(51.19,23.62) 51.19,13.11 50.34,12.26 41.49,12.26 v1(41.1,12.65)
$1N1264: length 16.2
  Top Layer w0.254: C4.2 35.19,15.47 U1.7 35.19,15.86 35.54,16.21 35.93,16.21 U1.6 ; 33.38,15.53 33.38,16.24 33.13,16.5 31.54,16.5 29.79,14.74 29.79,12.84 30.33,12.3 34.53,12.3 35.22,12.99
$1N1265: length 5.1
  Top Layer w0.254: U1.4 37.04,17.09 36.76,17.38 34.93,17.38 34.17,18.14 34.17,19.06 C1.1
$1N1266: length 4.7
  Top Layer w0.254: U1.2 38.04,17.87 37.72,18.19 36,18.19 35.9,18.29 C2.1
$1N1267: length 10
  Top Layer w0.254: C3.1 38.54,18.24 U1.1 ; C3.1 39.44,19.11 C5.1 41.07,19.13 D1.1 ; C3.1 37.1,19.11 arc(36.88,19.21) 36.78,19.43 36.78,20.37 arc(36.73,20.52) 36.58,20.58 35.96,20.58 arc(35.91,20.56) C2.2
$1N1268: length 19
  Top Layer w0.254: v1(47.43,14.1) 47,13.67 47,8.08 48.24,6.83 49.64,6.83 49.64,6.05 49.51,5.92 Q1.4 ; U1.24 v1(41.2,15.47)
  Bottom Layer w0.254: 47.3,14.07 42.61,14.07 v1(41.2,15.47)
$1N1269: length 21
  Top Layer w0.254: v1(41,11) 40.98,11.03 38.47,11.03 38.04,11.45 U1.17 ; Q2.4 49.59,18.95 48.88,18.95 48.54,18.62 48.54,14.23 49.1,13.67 v1(49.1,11.03)
  Bottom Layer w0.254: v1(49.1,11.03) 49.08,11 v1(41,11)
$1N1297: length 7.1
  Top Layer w0.254: U1.3 37.54,17.45 37.19,17.81 35.41,17.81 34.93,18.29 34.93,20.51 C1.2
$1N1308: length 1.8
  Top Layer w0.254: R1.2 26.34,23.56 LED1.1
$1N1312: length 6.4
  Top Layer w0.254: 32.59,9.91 U4.1 29.89,9.91 R3.2
  Bottom Layer w0.254: 29.43,10.09 29.61,9.91 v1(32.67,9.91)
$1N1315: length 6.3
  Top Layer w0.254: v1(32.67,6.88) 29.89,6.86 R6.1
  Bottom Layer w0.254: R17.2 32.5,7.05 v1(32.67,6.88)
$3N3922: length 27
  Top Layer w0.254: 3.84,22.2 3.84,23.34 v1(3.87,23.37) ; 19.39,12.46 19.34,12.51 v1(18.38,12.51)
  Bottom Layer w0.254: v1(18.38,12.51) 18.87,12.51 19.22,12.87 19.22,19.81 16,23.03 4.2,23.03 v1(3.87,23.37)
$3N3923: length 27.3
  Top Layer w0.254: 19.25,13.94 18.43,13.94 16.61,12.12 16.61,11.37 ; v1(7.44,11.4) 7.44,12.3 5.55,14.19 3.1,14.19 1.8,12.89 1.81,12.89 1.81,10.1 4.11,7.8 4.15,7.8
  Bottom Layer w0.254: v1(16.59,11.21) 16.4,11.4 v1(7.44,11.4)
$3N3924: length 8.1
  Top Layer w0.254: v1(24.31,11.1) 23.95,11.46 23.58,11.46 23.5,11.38 23.5,11 23.14,10.64 22.76,10.64 U6.6 ; C11.2 25.54,13.96 24.27,13.96 ; 24.27,13.96 23.58,13.96 ; 24.27,13.96 v1(24.27,14.43)
  Bottom Layer w0.254: v1(24.31,11.1) 24.31,14.38 v1(24.27,14.43)
$3N3925: length 5.7
  Top Layer w0.254: U6.4 21.73,9.73 21.96,9.5 24.47,9.5 24.85,9.12 24.85,8.07 C8.1
$3N3926: length 5
  Top Layer w0.254: U6.2 20.73,9.01 21.06,8.69 22.99,8.69 23.17,8.51 23.17,7.97 C9.1
$3N3927: length 9.8
  Top Layer w0.254: C10.1 19.69,7.87 19.69,8.79 20.24,9.33 U6.1 ; C10.1 21.45,7.82 C12.1 21.61,7.86 22.38,7.09 23.09,7.09 23.32,6.86 C9.2 ; C10.1 19.59,7.77 18.4,7.77 18.03,8.13 D3.1
$3N3928: length 30.9
  Top Layer w0.254: v1(9.81,13.89) 9.12,14.59 9.12,15.2 ; 19.39,11.46 19.32,11.46 18.35,10.5 v1(17.48,10.5)
  Bottom Layer w0.254: v1(9.81,13.89) 9.7,14 9.7,14.2 ; v1(17.48,10.5) 17.28,10.7 17.28,13.62 17.43,13.77 17.79,13.77 18.15,14.12 18.15,19.23 15.39,21.99 10.54,21.99 10.28,21.74 10.28,14.22 9.81,13.75
$3N3929: length 27.8
  Top Layer w0.254: 20.71,14.83 20.71,15.5 20.49,15.72 17.75,15.72 16.58,14.55 16.58,14.37 ; 9.35,2.11 9.25,2.01 9.25,1.12 9.48,0.89 10.06,0.89 10.44,1.27 10.44,8.66 9.61,9.5 9.61,13.16
  Bottom Layer w0.254: v1(9.48,13.16) 15.45,13.16 v1(16.55,14.25)
$3N3958: length 7.4
  Top Layer w0.254: U6.3 21.24,9.32 21.46,9.09 23.98,9.09 24.19,8.89 24.19,7.14 24.91,6.41 C8.2
$3N3966: length 5.9
  Top Layer w0.254: 26.2,16.99 U8.1 28.69,16.99 R10.2
  Bottom Layer w0.254: v1(26.18,16.99) 26.79,16.99 27.17,16.61 28.35,16.61 ; 28.35,16.61 28.38,16.65 ; 28.35,16.61 28.87,16.61 R16.2
$3N3971: length 4.7
  Top Layer w0.254: 26.08,19.82 26.18,19.92 v1(26.18,20.05) ; R13.1 28.74,20.05 U9.1
  Bottom Layer w0.254: R2.2 27.04,19.7 26.69,20.05 v1(26.18,20.05)

## Copper pours and planes (outline as drawn; the poured copper is in the pictures)
3V3 on Top Layer: 27.89,16.78 30.92,16.78 30.92,14 27.89,14
L_A on Top Layer: 0.21,21.21 10.09,21.21 10.09,15.72 0.21,15.72
L_B on Top Layer: 0.28,6.39 10.09,6.39 10.09,2.54 0.28,2.54
L_B on Top Layer: 0.27,7.4 3.02,7.4 3.02,1.58 0.27,1.58
L_B on Top Layer: 2.27,7.76 3.44,7.76 3.44,1.55 2.27,1.55
L_B on Top Layer: 3.56,6.71 8.28,6.71 8.28,1.52 3.56,1.52
R_A on Top Layer: 48.49,5.46 58.73,5.46 58.73,1.42 48.49,1.42
R_A on Top Layer: 50.3,6.59 58.72,6.59 58.72,5.44 50.3,5.44
R_B on Top Layer: 49.08,18.49 58.76,18.49 58.76,14.43 49.08,14.43
R_B on Top Layer: 50.35,21.21 58.73,21.21 58.73,16.44 50.35,16.44
VM on Top Layer: 8.91,28.49 14.97,28.49 14.97,17.1 8.91,17.1
VM on Top Layer: 12.5,20.19 46.28,20.19 46.28,0.64 12.5,0.64
VM on Bottom Layer: 12.48,20.09 15.75,20.09 15.75,14.42 12.48,14.42
VM on Bottom Layer: 42.85,10.21 46.26,10.21 46.26,3.94 42.85,3.94
VM on Bottom Layer: 15.82,4.36 46.26,4.36 46.26,0.64 15.82,0.64
VM on Bottom Layer: 12.48,10.67 15.8,10.67 15.8,0.61 12.48,0.61
VM on Bottom Layer: 42.85,19.79 46.28,19.79 46.28,14.86 42.85,14.86

## Text on the board
Top Silkscreen Layer: GND | VM | 5V | M1 | PWM1 | M2 | PWM2
